# EAGLE design IF (EAGLE 7.2.0)
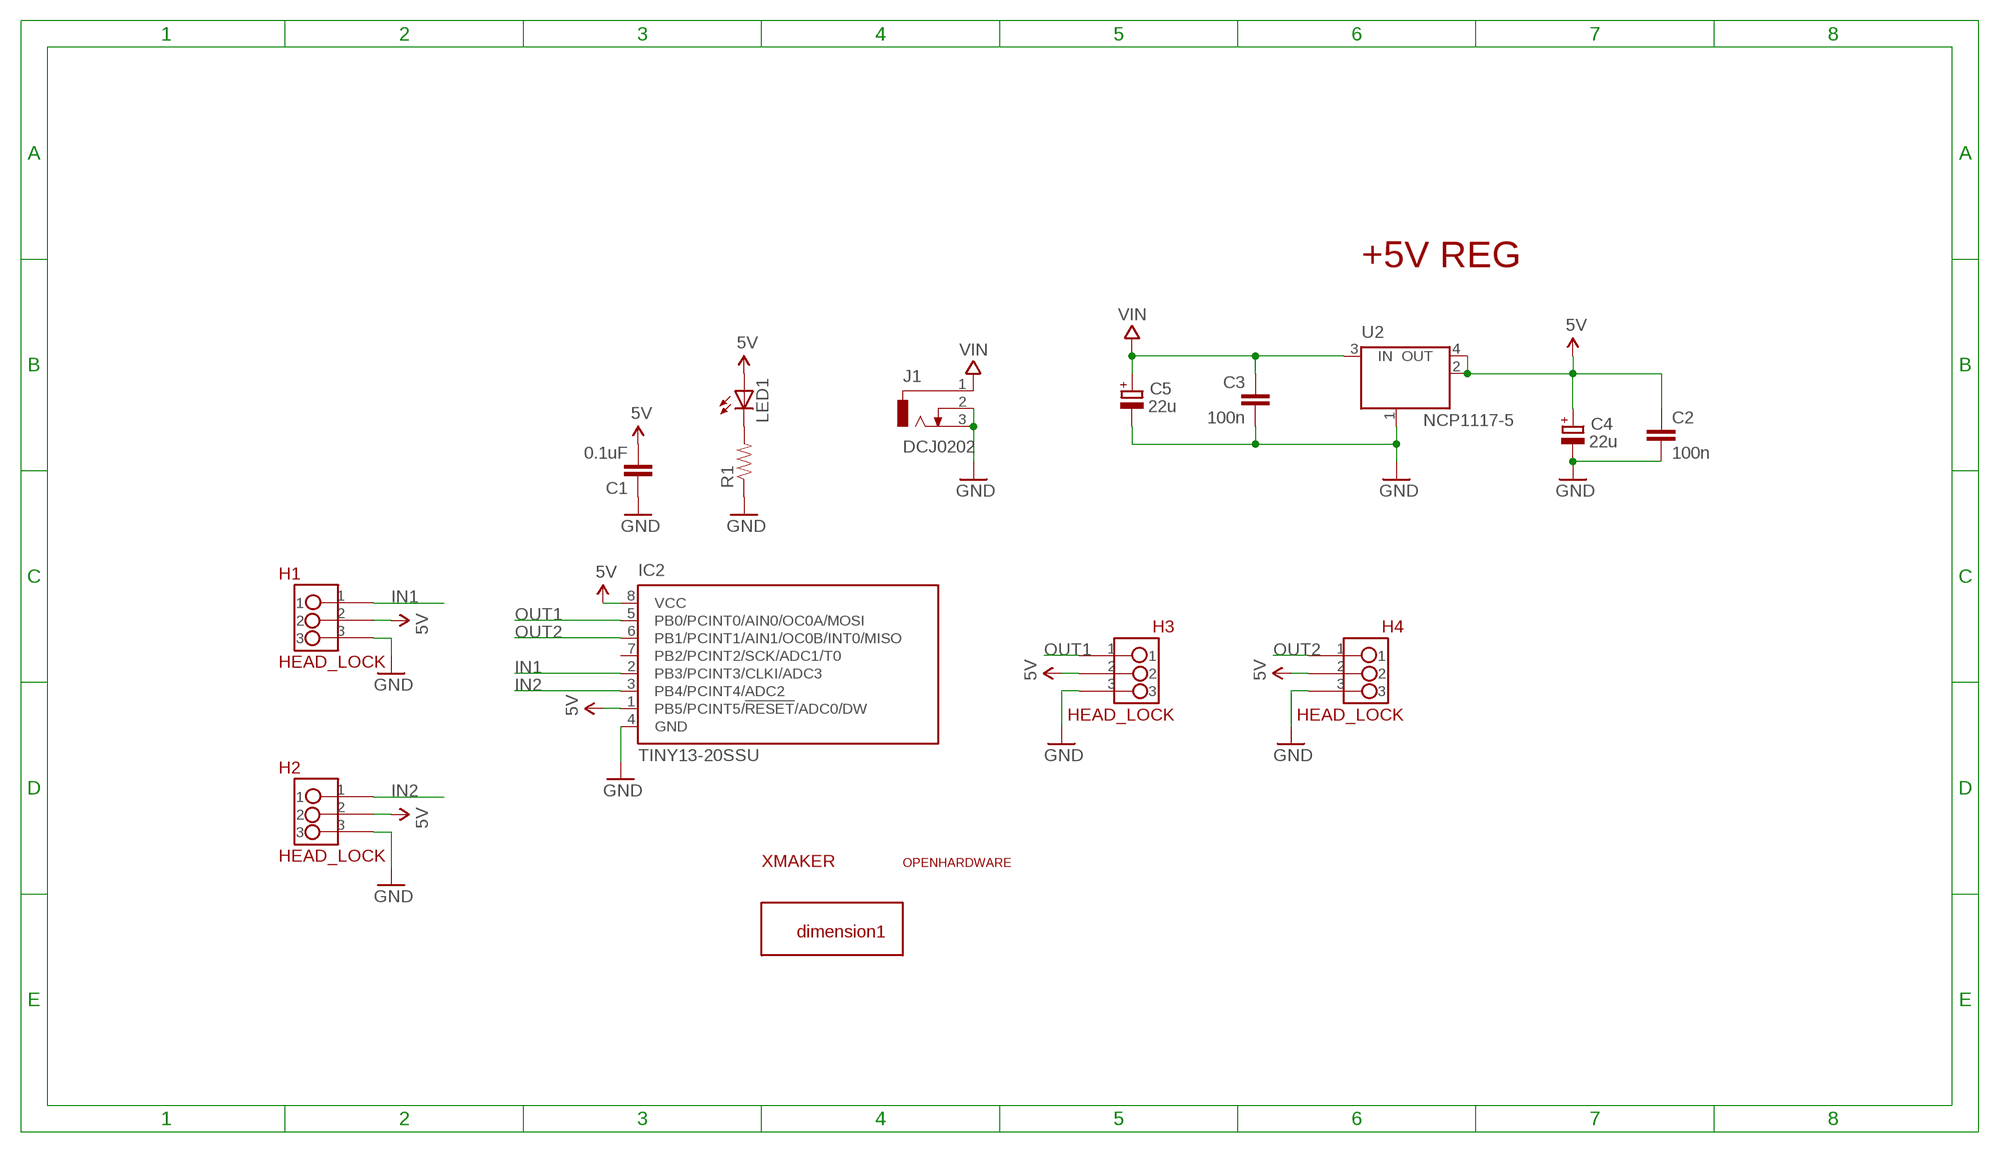
[diagram p0: schematic, sheet 1]

## Parts
C1  0.1uF  0.1UF-25V(+80/-20%)(0603)  [0603-CAP]
C2  100n  C-EUC0402  [C0402]
C3  100n  C-EUC0402  [C0402]
C4  22u  CPOL-EUSMCB  [SMC_B]
C5  22u  CPOL-EUSMCB  [SMC_B]
H1  HEAD_LOCK  [HEAD_LOCK]
H2  HEAD_LOCK  [HEAD_LOCK]
H3  HEAD_LOCK  [HEAD_LOCK]
H4  HEAD_LOCK  [HEAD_LOCK]
IC2  TINY13-20SSU  [8S1]
J1  DCJ0202  [DCJ0202]
LED1  LEDSML0603  [SML0603]
R1  RESISTOR0603-RES  [0603-RES]
U2  NCP1117-5  LINEAR_MC33269ST  [LINEAR_SOT223]
U$2  XMAKERLOGO2  [XMAKERLOGO2]
U$3  OPENHARDWARE  [OPENHARDWARE]
U$4  DIMENSION1  [DIMENSION1]

## Nets
5V: C1.2 C2.1 C4.+ H1.2 H2.2 H3.2 H4.2 IC2.1(PB5/PCINT5/!RESET!/ADC0/DW) IC2.8(VCC) LED1.A U2.2(OUT) U2.4(OUT)
GND: C1.1 C2.2 C3.2 C4.- C5.- H1.3 H2.3 H3.3 H4.3 IC2.4(GND) J1.2 J1.3 R1.1 U2.1(GND/ADJ)
IN1: H1.1 IC2.2(PB3/PCINT3/CLKI/ADC3)
IN2: H2.1 IC2.3(PB4/PCINT4/ADC2)
N$1: LED1.C R1.2
OUT1: H3.1 IC2.5(PB0/PCINT0/AIN0/OC0A/MOSI)
OUT2: H4.1 IC2.6(PB1/PCINT1/AIN1/OC0B/INT0/MISO)
VIN: C3.1 C5.+ J1.1 U2.3(IN)
Unconnected: IC2.7(PB2/PCINT2/SCK/ADC1/T0)

## Notes on the sheet
- +5V REG

## Library data of the parts
C1 = SparkFun-Capacitors:0.1UF-25V(+80/-20%)(0603): CAP-00810 Ceramic Standard decoupling cap; PROD_ID: CAP-00810
C2 C3 = SmartPrj:C-EU: CAPACITOR, European symbol
C4 C5 = rcl:CPOL-EU: POLARIZED CAPACITOR, European symbol
H1-H4 = HEAD_LOCK:HEAD_LOCK: 带锁的排座
IC2 = atmel:TINY13: 8-bit AVR Microcontroller with 1K Bytes In-System Programmable Flash Source: http://www.atmel.com/dyn/resources/prod_documents/2535S.pdf; MPN: ATTINY13-20SSU; OC_FARNELL: 1455133; OC_NEWARK: 58M3771
J1 = con-jack:DCJ0202: DC POWER JACK Source: DCJ0202.pdf; OC_FARNELL: unknown; OC_NEWARK: unknown
LED1 = led:LED: LED OSRAM: - CHIPLED LG R971, LG N971, LY N971, LG Q971, LY Q971, LO R971, LY R971 LH N974, LH R974 LS Q976, LO Q976, LY Q976 LO Q996 - Hyper CHIPLED LW Q18S LB Q993, LB Q99A, LB R99A - SideLED LS A670, LO A670, LY A670, LG A670, LP A670 LB A673, LV A673, LT A673, LW A673 LH A674 LY A675 LS A676, LA A676, LO A676, LY A676, LW A676 LS A679, LY A679, LG A679 - Hyper Micro SIDELED® LS Y876, LA Y876, LO Y876, LY Y876 LT Y87S - SmartLED LW L88C, LW L88S LB L89C, LB L89S, LG L890 LS L89K, LO L89K, LY L89K LS L896, LA L896, LO L896, LY L896 - TOPLED LS T670, LO T670, LY T670, LG T670, LP T670 LSG T670, LSP T670, LSY T670, LOP T670, LYG T670 LG T671, LOG T671, LSG T671 LB T673, LV T673, LT T673, LW T673 LH T674 LS T676, LA T676, LO T676, LY T676, LB T676, LH T676, LSB T676, LW T676 LB T67C, LV T67C, LT T67C, LS T67K, LO T67K, LY T67K, LW E67C LS E67B, LA E67B, LO E67B, LY E67B, LB E67C, LV E67C, LT E67C LW T67C LS T679, LY T679, LG T679 LS T770, LO T770, LY T770, LG T770, LP T770 LB T773, LV T773, LT T773, LW T773 LH T774 LS E675, LA E675, LY E675, LS T675 LS T776, LA T776, LO T776, LY T776, LB T776 LHGB T686 LT T68C, LB T68C - Hyper Mini TOPLED® LB M676 - Mini TOPLED Santana® LG M470 LS M47K, LO M47K, LY M47K Source: http://www.osram.convergy.de LUXEON: - LUMILED® LXK2-PW12-R00, LXK2-PW12-S00, LXK2-PW14-U00, LXK2-PW14-V00 LXK2-PM12-R00, LXK2-PM12-S00, LXK2-PM14-U00 LXK2-PE12-Q00, LXK2-PE12-R00, LXK2-PE12-S00, LXK2-PE14-T00, LXK2-PE14-U00 LXK2-PB12-K00, LXK2-PB12-L00, LXK2-PB12-M00, LXK2-PB14-N00, LXK2-PB14-P00, LXK2-PB14-Q00 LXK2-PR12-L00, LXK2-PR12-M00, LXK2-PR14-Q00, LXK2-PR14-R00 LXK2-PD12-Q00, LXK2-PD12-R00, LXK2-PD12-S00 LXK2-PH12-R00, LXK2-PH12-S00 LXK2-PL12-P00, LXK2-PL12-Q00, LXK2-PL12-R00 Source: www.luxeon.com KINGBRIGHT: KA-3528ASYC Source: www.kingbright.com
R1 = SparkFun-Passives:RESISTOR: Resistor Basic schematic elements and footprints for 0603, 1206, and PTH resistors.
U2 = SmartPrj:LINEAR_MC33269ST*: Adjustable Output Low Dropout Voltage Regulator 800 mA Source: http://www.onsemi.com/pub/Collateral/MC33269-D.PDF
U$2 = Xmaker_yuhui:XMAKERLOGO2
U$3 = Xmaker_yuhui:OPENHARDWARE
U$4 = Xmaker_yuhui:DIMENSION1

## Net classes
0 default: width 0.254 mm, drill 0.61 mm, clearance 0.203 mm

## Board
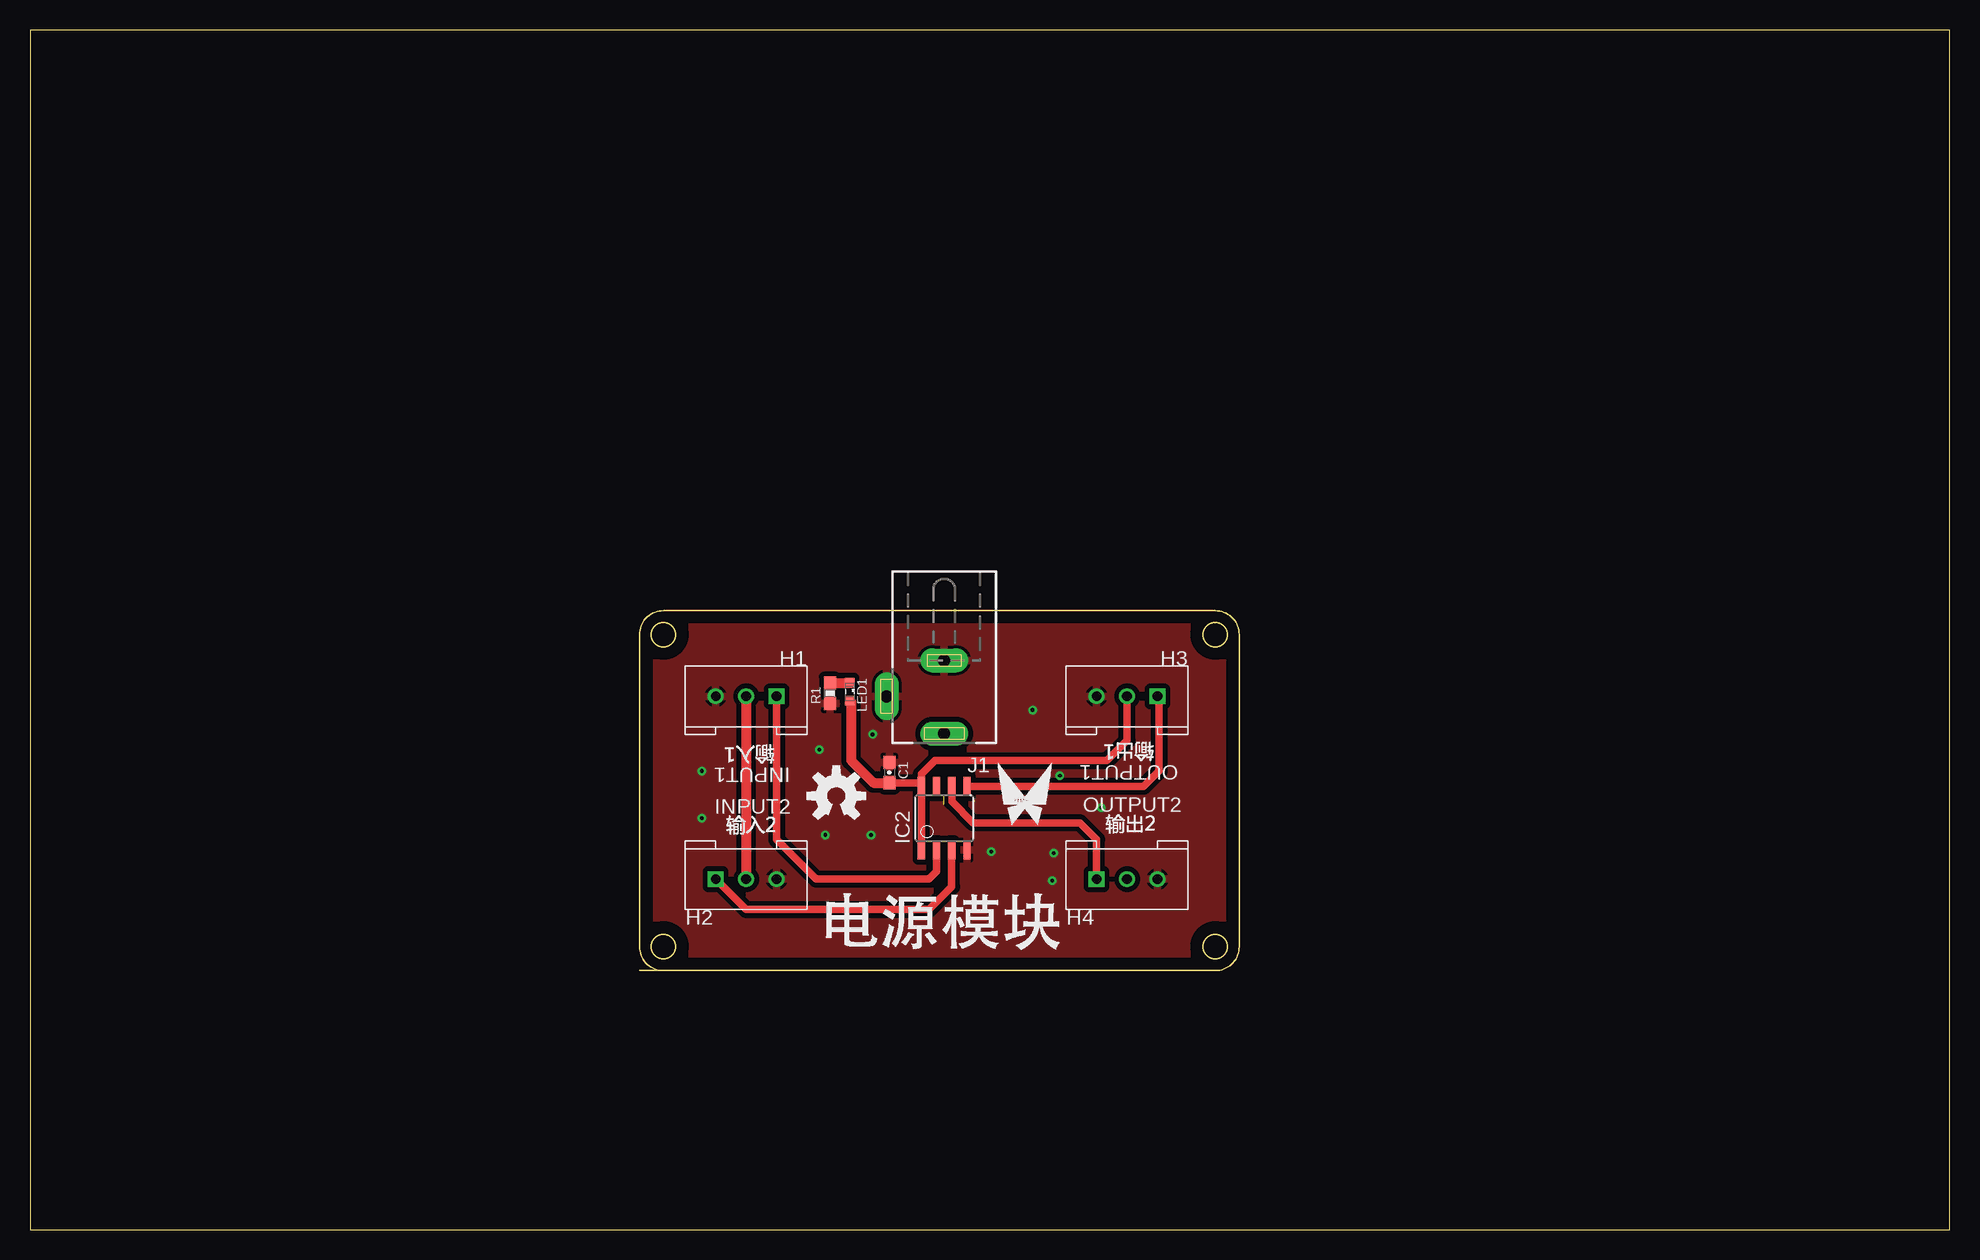
[diagram p1: board, top side]
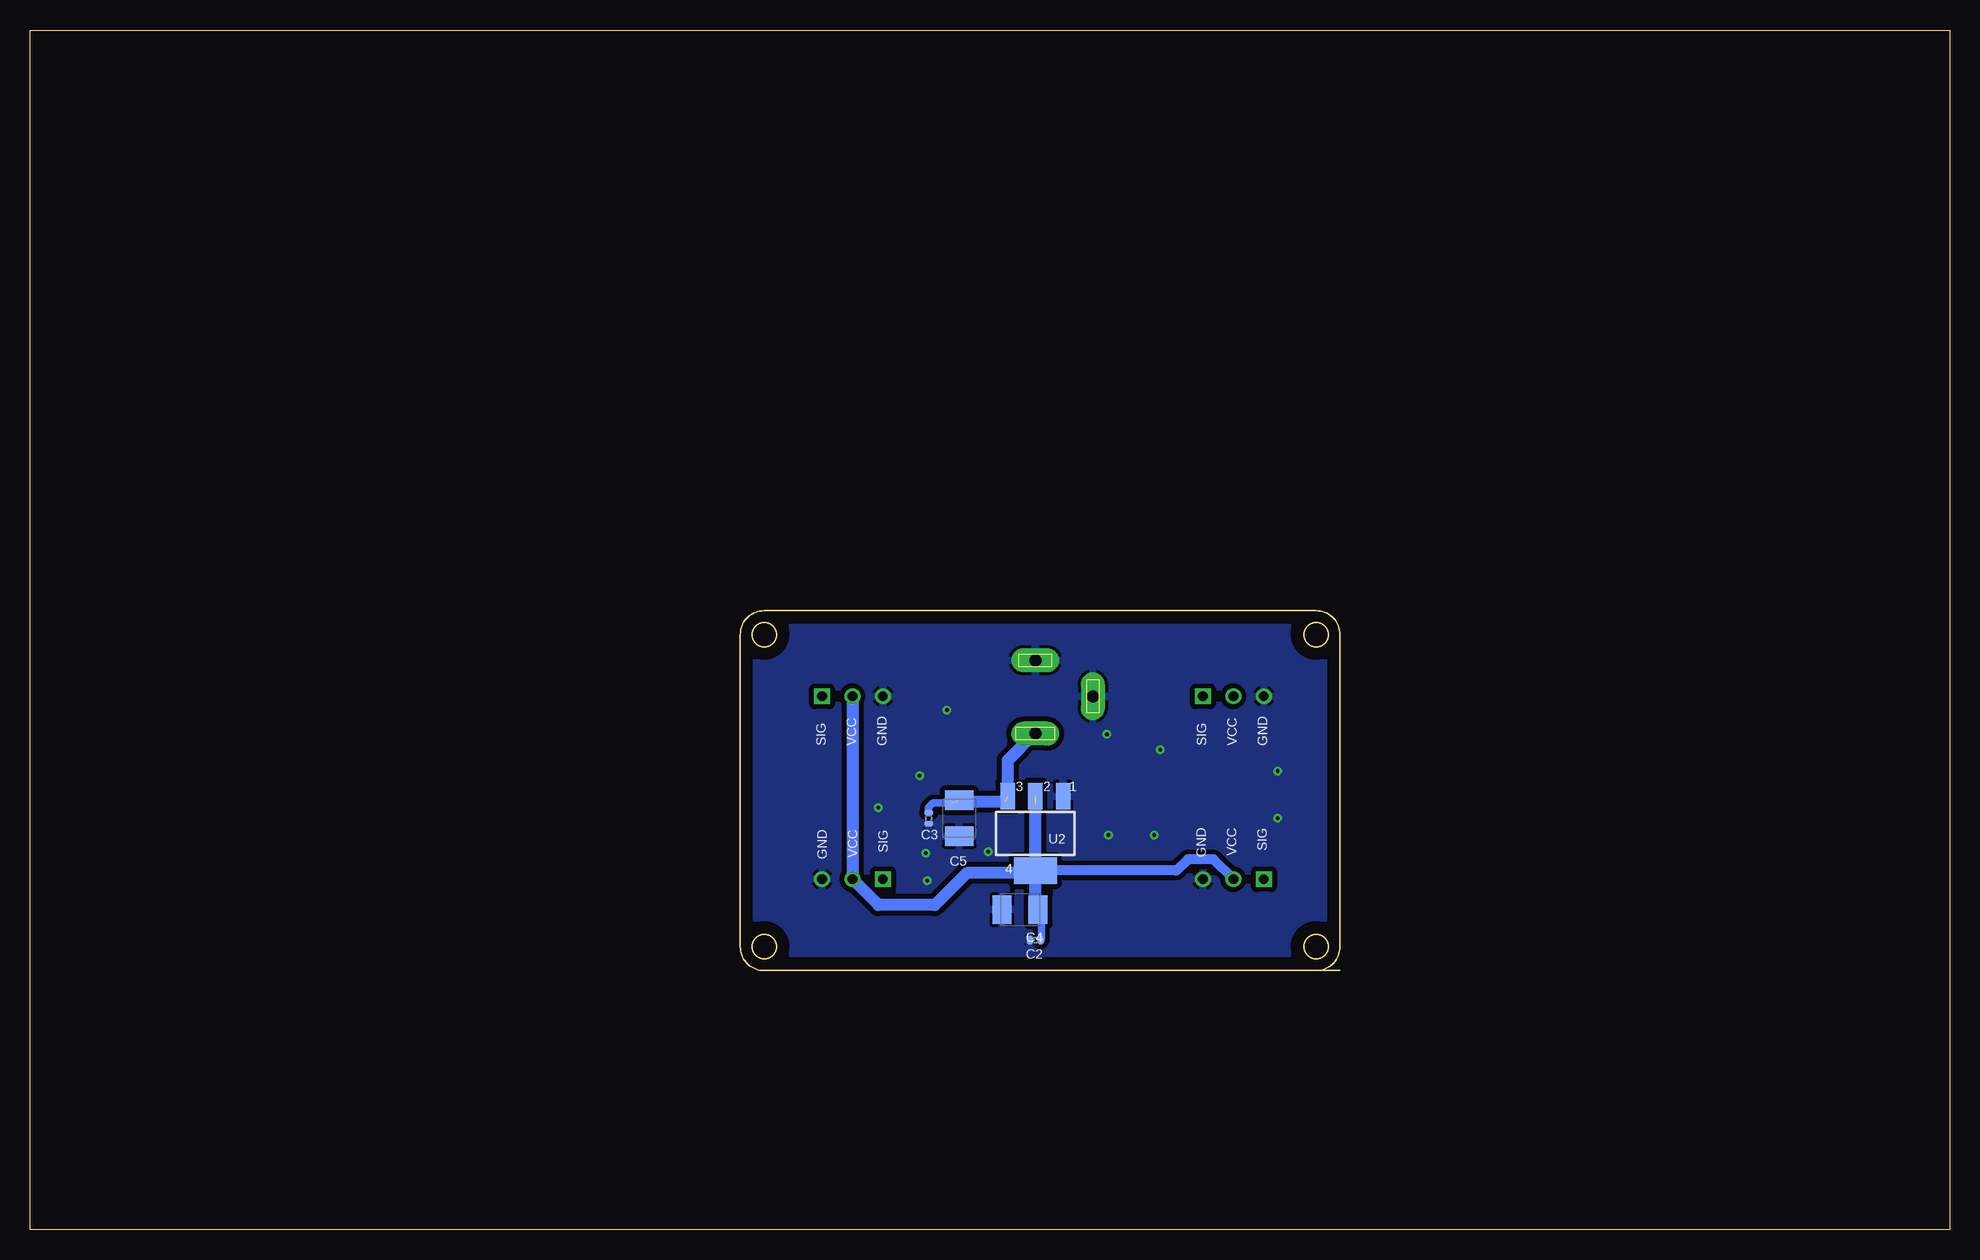
[diagram p2: board, bottom side, seen from below]

Size 160 x 100 mm. Coordinates in mm from the lower left corner, seen from the top.
Outline: 0,0 160,0 160,100 0,100 0,0
Copper layers (1*16): Top 0.035mm / dielectric 1.5mm / Bottom 0.035mm
Design rules "default": minimum track width 10mil, minimum drill 24mil, track to track 8mil, track to pad 8mil, pad to pad 8mil, via to via 8mil, smd to smd 8mil, copper to edge 40mil, drill to drill 8mil, minimum pad ring 10mil, minimum via ring 8mil, stop-mask expansion 4mil, vias tented up to drill 0mil, thermal gap 10mil

### Footprints (pad centres in the part's own frame; a part is rotated, then mirrored left to right if it is on the bottom)
0603-CAP = smd 1.1 x 1: 1 -0.85,0; 2 0.85,0
C0402 = smd 0.508 x 0.762: 1 -0.445,0; 2 0.445,0
SMC_B = smd 1.6 x 2.4: + -1.5,0; - 1.5,0
HEAD_LOCK = drill 0.8 square: 1 0,0 | drill 0.8: 2 2.54,0; 3 5.08,0
8S1 = smd 0.6 x 1.6: 1 -1.905,-2.654; 2 -0.645,-2.654; 3 0.625,-2.654; 4 1.895,-2.654; 5 1.905,2.654; 6 0.635,2.654; 7 -0.635,2.654; 8 -1.905,2.654
DCJ0202 = drill 1 pad 2 long: 1 0,3.1; 2 4.8,0; 3 0,-3
SML0603 = smd 0.8 x 0.8: A 0.75,0; C -0.75,0
0603-RES = smd 1.1 x 1: 1 -0.85,0; 2 0.85,0
LINEAR_SOT223 = smd 1.219 x 2.235: 1 -2.311,-3.099; 2 0,-3.099; 3 2.311,-3.099 | smd 3.6 x 2.2: 4 0,3.099

### Placement (x,y rotation side)
C1  71.63,38.1 270 top
C2  76.2,24.13 180 bottom
C3  85.09,34.29 270 bottom
C4  77.47,26.67 180 bottom
C5  82.55,34.29 270 bottom
H1  62.23,44.45 180 top
H2  57.15,29.21 0 top
H3  93.98,44.45 180 top
H4  88.9,29.21 0 top
IC2  76.2,34.29 0 top
J1  76.2,44.45 180 top
LED1  68.33,44.83 270 top
R1  66.67,44.7 90 top
U2  76.2,33.02 180 bottom
U$2  79.4,32.79 0 top
U$3  67.21,36.14 0 top
U$4  50.8,21.59 0 top

### Tracks (layer width: path | path; a pad name or v marks a point on that pad's centre or on a via)
5V  (1 unrouted)
  Top 0.254: IC2.8 74.17,37.07 74.17,37.34
  Top 0.61: IC2.1 IC2.8 74.3,37.97 75.44,39.12 89.79,39.12 91.44,40.77 H3.2 | 74.17,37.34 74.08,37.25 C1.2
  Top 0.813: H1.2 H2.2 | LED1.A 68.45,43.95 68.45,39.12 70.32,37.25 C1.2
  Bottom 0.254: C4.+ 75.75,26.46 C2.1
  Bottom 0.61: C2.1 75.69,24.19 75.69,25.78
  Bottom 0.813: H2.2 61.34,30.86 63.5,30.86 64.44,29.92 U2.4
  Bottom 1.016: C4.+ 76.2,26.9 U2.4 | U2.4 76.2,35.43 | U2.4 76.4,29.72 81.92,29.72 84.58,27.05 89.28,27.05 H4.2 H3.2
GND  (via drill 0.3)
  other vias: 56.01,38.23 56.01,34.29 80.14,31.5 85.22,29.08 85.34,31.37 66.29,32.89 70.1,32.89 65.79,40.01 70.23,41.27 83.57,43.31 85.85,37.85 89.28,35.18
  pour Top (isolate 0.406): 48.51,52.7 103.5,52.7 103.5,19.94 48.51,19.94
  pour Bottom (isolate 0.406): 48.51,52.7 103.5,52.7 103.5,19.94 48.39,19.94 48.39,52.83
IN1
  Top 0.61: H1.1 62.23,32.51 65.53,29.21 74.93,29.21 75.56,29.84 75.56,31.63 IC2.2
IN2
  Top 0.61: H2.1 59.69,26.67 74.93,26.67 76.83,28.57 IC2.3
N$1
  Top 0.813: R1.2 66.7,45.58 LED1.C
OUT1
  Top 0.61: H3.1 94.11,44.32 94.11,38.23 92.82,36.94 IC2.5
OUT2
  Top 0.61: H4.1 88.9,32.51 87.5,33.91 78.61,33.91 76.83,35.69 IC2.6
VIN  (2 unrouted)
  Bottom 0.254: C5.+ 82.65,35.69 82.68,35.69
  Bottom 0.61: C3.1 85.09,35.18 84.71,35.56 83.19,35.56
  Bottom 1.016: U2.3 78.49,36.14 78.49,39.12 76.25,41.35 J1.1 | C5.+ 82.45,35.69 78.74,35.69

### Text on the board
tPlace: INPUT1 | OUTPUT1 | INPUT2 | OUTPUT2 | C:/Users/Xiangzi/Desktop/Ãû³Æ/µçÔ´ģ¿é.bmp | C:/Users/Xiangzi/Desktop/Ãû³Æ/Êä³ö1.bmp | C:/Users/Xiangzi/Desktop/Ãû³Æ/Êä³ö2.bmp | C:/Users/Xiangzi/Desktop/Ãû³Æ/ÊäÈë1.bmp | C:/Users/Xiangzi/Desktop/Ãû³Æ/ÊäÈë2.bmp
bPlace: GND | VCC | SIG | GND | VCC | SIG | SIG | VCC | GND | SIG | VCC | GND